# Altium schematic sheet 01) Title Page.SchDoc
size 514 x 328 mm
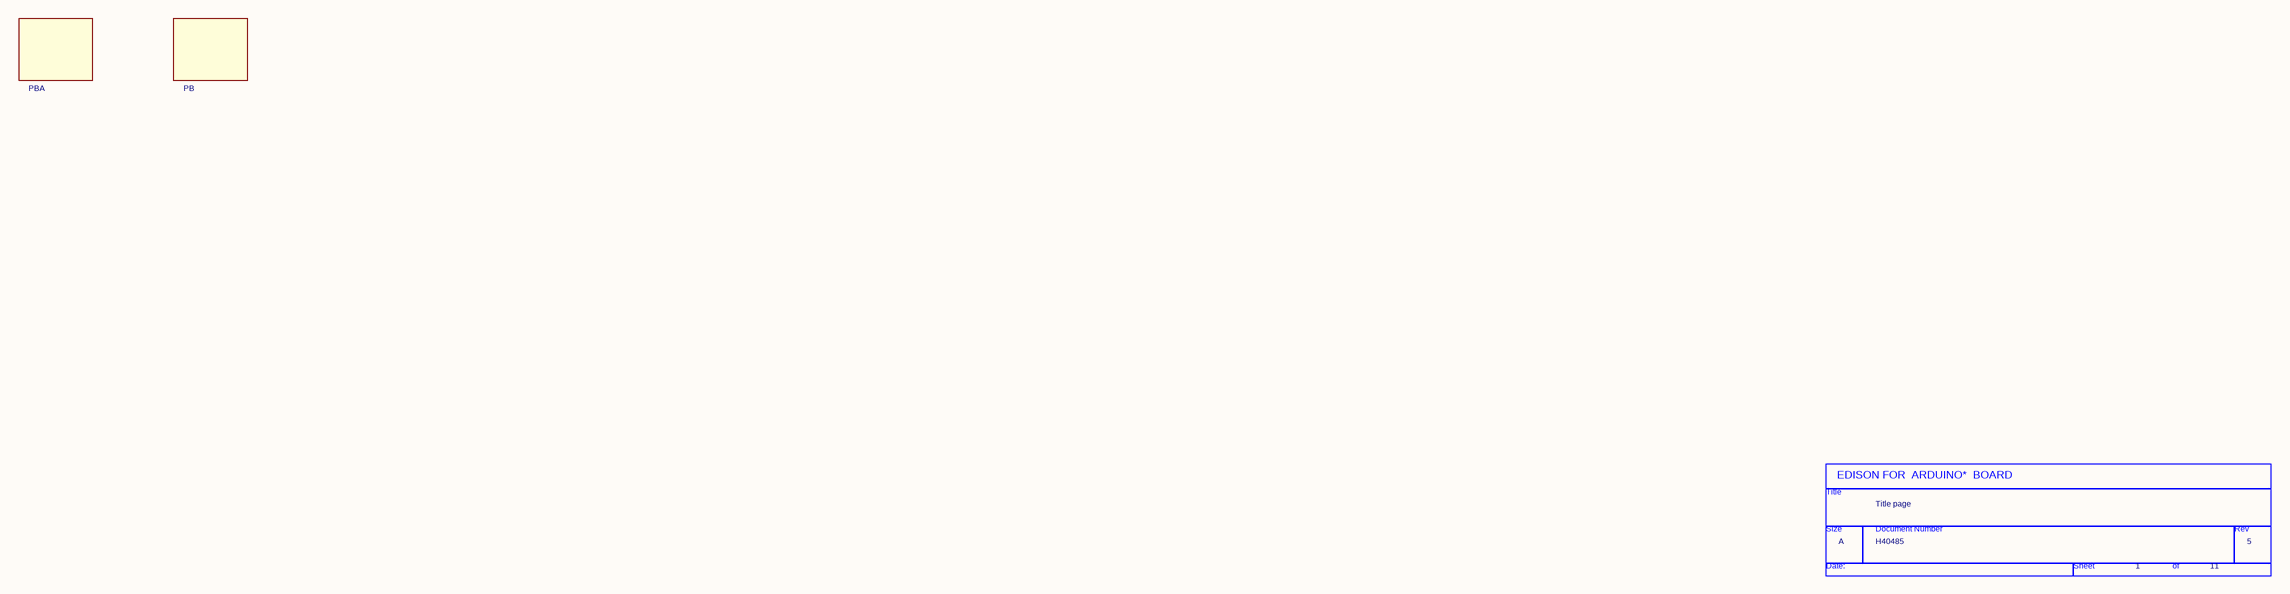
[diagram p0: 01) Title Page.SchDoc]

## Parts
*  Page Count: 11  Page Number: 1  Page Size: A  Title: Title page  RevCode: 5  Doc: H40485  (hidden comment: TitleBlock0)  (graphical)
A1  PBA
A2  PB

## Notes on the sheet
- (in symbol TitleBlock0) EDISON FOR  ARDUINO*  BOARD; Title; Size; Document Number; Rev; Date:; Sheet; of

## Library data of the parts
A1 = PBA: PBA, EDISON ARDUINO; PART_NUMBER: H40485-400
A2 = PBA: PB, EDISON ARDUINO, 1-UP; PART_NUMBER: H40482-004
* = TitleBlock0: Page Create Date: March  8, 1995